# EAGLE board ATmga8_testBoard_v4 (EAGLE 6.5.0), part 1 of 3
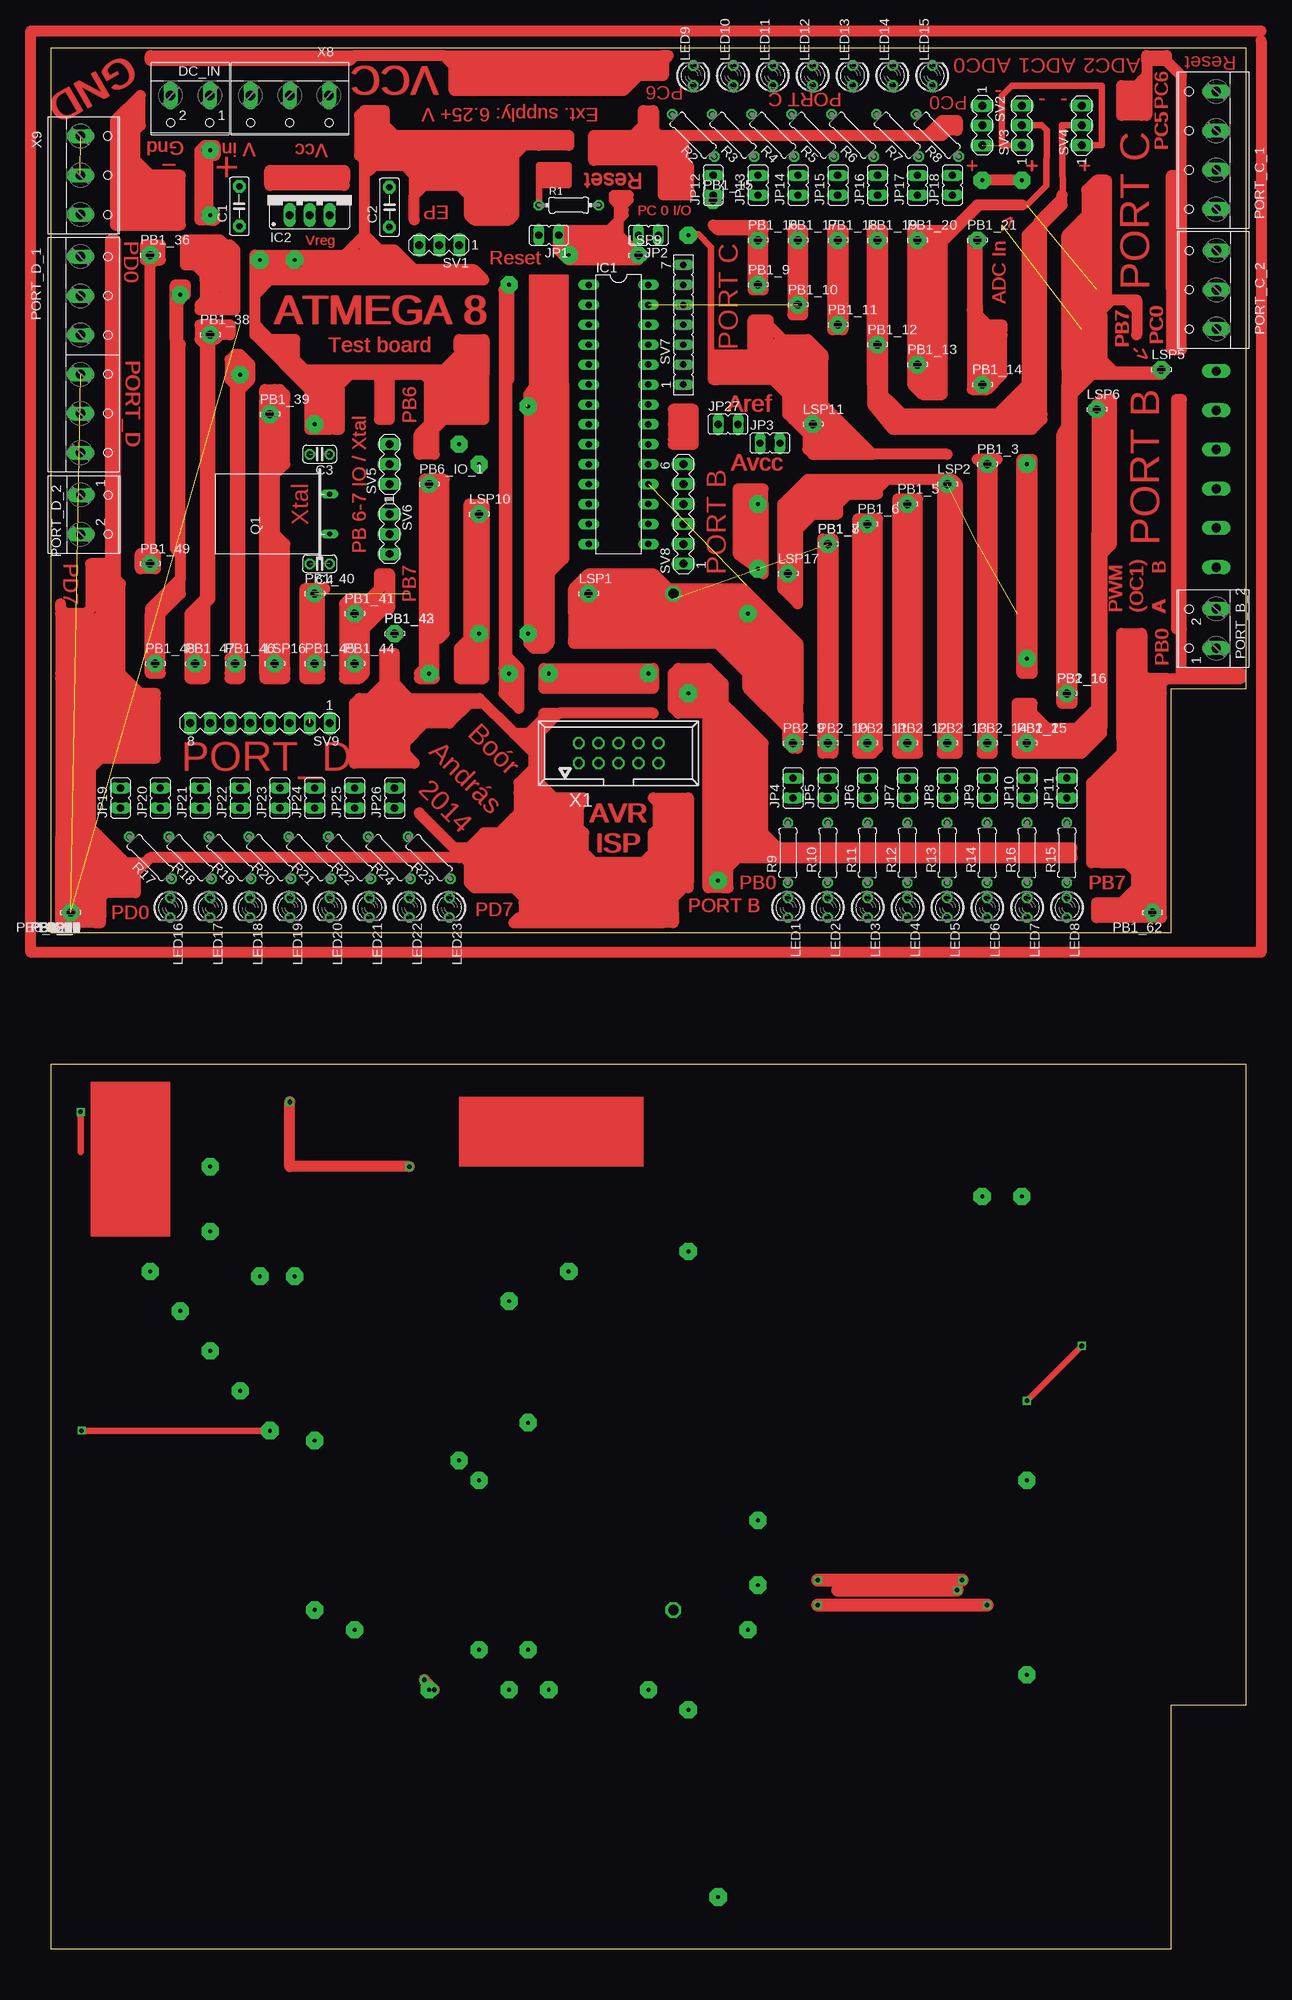
[diagram p1: board, top side]
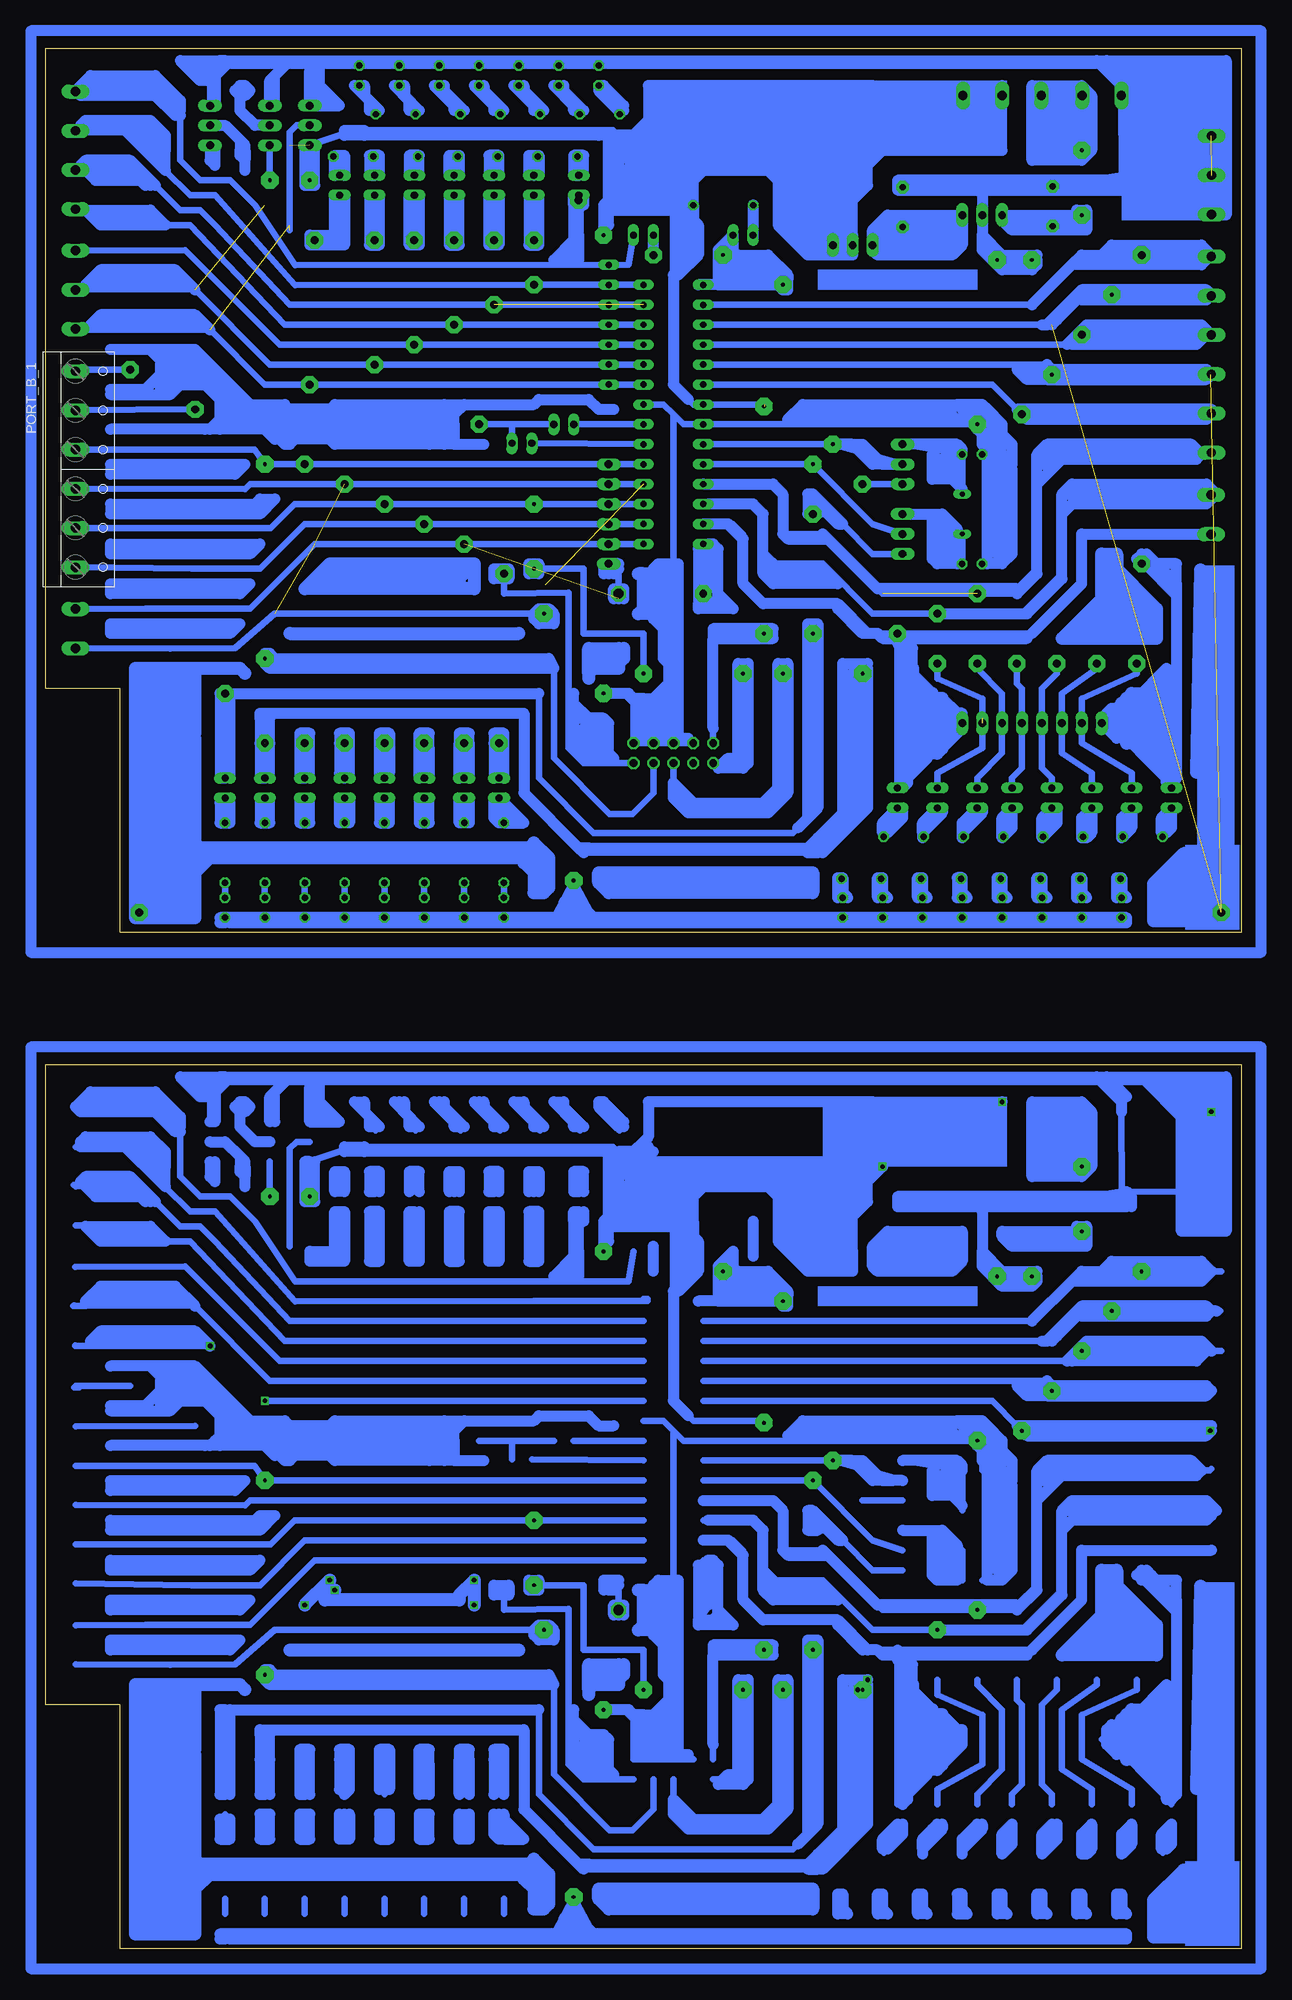
[diagram p2: board, bottom side, seen from below]

Size 152.4 x 242.24 mm. Coordinates in mm from the lower left corner, seen from the top.
Outline: 0,129.54 142.88,129.54 142.88,160.66 152.4,160.66 152.38,242.24 0,242.24 0,129.54
Outline: 0,0 142.88,0 142.88,31.11 152.4,31.11 152.38,112.7 0,112.7 0,0
Copper layers (1*16): Top 0.035mm / dielectric 1.5mm / Bottom 0.035mm
Design rules "default": minimum track width 10mil, minimum drill 24mil, track to track 8mil, track to pad 8mil, pad to pad 8mil, via to via 8mil, smd to smd 8mil, copper to edge 40mil, drill to drill 8mil, minimum pad ring 10mil, minimum via ring 8mil, stop-mask expansion 4mil, vias tented up to drill 0mil, thermal gap 10mil

## Footprints (pad centres in the part's own frame; a part is rotated, then mirrored left to right if it is on the bottom)
C5B2.5 = drill 0.813 pad 1.6 octagon: 1 -2.54,0; 2 2.54,0
C025-024X044 = drill 0.813 octagon: 1 -1.27,0; 2 1.27,0
W237-102 = drill 1.194 long: 1 -2.5,-1.27; 2 2.5,-1.27
DIL28-3 = drill 0.813 long: 1 -16.51,-3.81; 2 -13.97,-3.81; 3 -11.43,-3.81; 4 -8.89,-3.81; 5 -6.35,-3.81; 6 -3.81,-3.81; 7 -1.27,-3.81; 8 1.27,-3.81; 9 3.81,-3.81; 10 6.35,-3.81; 11 8.89,-3.81; 12 11.43,-3.81; 13 13.97,-3.81; 14 16.51,-3.81; 15 16.51,3.81; 16 13.97,3.81; 17 11.43,3.81; 18 8.89,3.81; 19 6.35,3.81; 20 3.81,3.81; 21 1.27,3.81; 22 -1.27,3.81; 23 -3.81,3.81; 24 -6.35,3.81; 25 -8.89,3.81; 26 -11.43,3.81; 27 -13.97,3.81; 28 -16.51,3.81
78XXS = drill 1.016 long: GND 0,-2.54; IN -2.54,-2.54; OUT 2.54,-2.54
JP1 = drill 0.914 long: 1 0,-1.27; 2 0,1.27
LED3MM = drill 0.813 octagon: A -1.27,0; K 1.27,0
LSP10 = drill 1.016 pad 2.159 octagon: MP 0,0
W237-6 = drill 1.194 long: 1 -12.5,-1.27; 2 -7.5,-1.27; 3 -2.5,-1.27; 4 2.5,-1.27; 5 7.5,-1.27; 6 12.5,-1.27
W237-4 = drill 1.194 long: 1 -7.5,-1.27; 2 -2.5,-1.27; 3 2.5,-1.27; 4 7.5,-1.27
W237-103 = drill 1.194 long: 1 -5,-1.29; 2 0,-1.29; 3 5,-1.29
Q = drill 0.61 long: 1 -2.54,-7.62; 2 2.54,-7.62
0204/7 = drill 0.813 octagon: 1 -3.81,0; 2 3.81,0
0207/7 = drill 0.813 octagon: 1 -3.81,0; 2 3.81,0
MA03-1 = drill 1.016 long: 1 -2.54,0; 2 0,0; 3 2.54,0
FE07 = drill 0.813 long: 1 -7.62,0; 2 -5.08,0; 3 -2.54,0; 4 0,0; 5 2.54,0; 6 5.08,0; 7 7.62,0
MA06-1 = drill 1.016 long: 1 -6.35,0; 2 -3.81,0; 3 -1.27,0; 4 1.27,0; 5 3.81,0; 6 6.35,0
MA08-1 = drill 1.016 long: 1 -8.89,0; 2 -6.35,0; 3 -3.81,0; 4 -1.27,0; 5 1.27,0; 6 3.81,0; 7 6.35,0; 8 8.89,0
057-010-1 = drill 1 octagon: 1 -5.08,-1.27; 2 -5.08,1.27; 3 -2.54,-1.27; 4 -2.54,1.27; 5 0,-1.27; 6 0,1.27; 7 2.54,-1.27; 8 2.54,1.27; 9 5.08,-1.27; 10 5.08,1.27

## Placement (x,y rotation side)
C1  0.33_uF  [C5B2.5]  24.05,222.11 90 top
C2  0.33_uF  [C5B2.5]  43.18,222 90 top
C3  [C025-024X044]  34.29,190.5 180 top
C4  [C025-024X044]  34.29,176.53 180 top
DC_IN  [W237-102]  17.78,234.95 180 top
IC1  ATmega8  [DIL28-3]  72.39,195.58 270 top
IC2  7805_CV  [78XXS]  33.02,223.52 0 top
JP1  PC0_Reset  [JP1]  63.5,218.44 90 top
JP2  PC0_IO  [JP1]  76.2,218.44 90 top
JP3  [JP1]  91.69,191.9 270 top
JP4  [JP1]  94.61,147.95 0 top
JP5  [JP1]  99.06,147.95 0 top
JP6  [JP1]  104.14,147.95 0 top
JP7  [JP1]  109.22,147.95 0 top
JP8  [JP1]  114.3,147.95 0 top
JP9  [JP1]  119.38,147.95 0 top
JP10  [JP1]  124.46,147.95 0 top
JP11  [JP1]  129.54,147.95 0 top
JP12  [JP1]  84.45,224.79 0 top
JP13  [JP1]  90.17,224.79 0 top
JP14  [JP1]  95.25,224.79 0 top
JP15  [JP1]  100.33,224.79 0 top
JP16  [JP1]  105.41,224.79 0 top
JP17  [JP1]  110.49,224.79 0 top
JP18  [JP1]  114.94,224.79 0 top
JP19  [JP1]  8.89,146.69 0 top
JP20  [JP1]  13.97,146.69 0 top
JP21  [JP1]  19.05,146.69 0 top
JP22  [JP1]  24.13,146.69 0 top
JP23  [JP1]  29.21,146.69 0 top
JP24  [JP1]  33.66,146.69 0 top
JP25  [JP1]  38.73,146.69 0 top
JP26  [JP1]  43.81,146.69 0 top
JP27  VREF_VCC  [JP1]  86.36,194.31 270 top
LED1  [LED3MM]  93.98,132.72 270 top
LED2  [LED3MM]  99.06,132.72 270 top
LED3  [LED3MM]  104.14,132.72 270 top
LED4  [LED3MM]  109.22,132.72 270 top
LED5  [LED3MM]  114.3,132.72 270 top
LED6  [LED3MM]  119.38,132.72 270 top
LED7  [LED3MM]  124.46,132.72 270 top
LED8  [LED3MM]  129.54,132.72 270 top
LED9  [LED3MM]  81.92,238.76 90 top
LED10  [LED3MM]  87,238.76 90 top
LED11  [LED3MM]  92.08,238.76 90 top
LED12  [LED3MM]  97.16,238.76 90 top
LED13  [LED3MM]  102.23,238.76 90 top
LED14  [LED3MM]  107.31,238.76 90 top
LED15  [LED3MM]  112.39,238.76 90 top
LED16  [LED3MM]  15.24,132.72 270 top
LED17  [LED3MM]  20.32,132.72 270 top
LED18  [LED3MM]  25.4,132.72 270 top
LED19  [LED3MM]  30.48,132.72 270 top
LED20  [LED3MM]  35.56,132.72 270 top
LED21  [LED3MM]  40.64,132.72 270 top
LED22  [LED3MM]  45.72,132.72 270 top
LED23  [LED3MM]  50.8,132.72 270 top
LSP1  LSP10  [LSP10]  68.58,172.72 0 top
LSP2  LSP10  [LSP10]  114.3,186.69 0 top
LSP3  LSP10  [LSP10]  2.54,132.08 180 top
LSP4  LSP10  [LSP10]  2.54,132.08 180 top
LSP5  LSP10  [LSP10]  141.6,201.29 0 top
LSP6  LSP10  [LSP10]  133.35,196.21 0 top
LSP7  LSP10  [LSP10]  2.54,132.08 180 top
LSP8  LSP10  [LSP10]  2.54,132.08 180 top
LSP9  LSP10  [LSP10]  74.93,215.9 0 top
LSP10  LSP10  [LSP10]  54.61,182.88 0 top
LSP11  LSP10  [LSP10]  97.16,194.31 0 top
LSP12  LSP10  [LSP10]  2.54,132.08 180 top
LSP13  LSP10  [LSP10]  2.54,132.08 180 top
LSP14  LSP10  [LSP10]  2.54,132.08 180 top
LSP15  LSP10  [LSP10]  2.54,132.08 180 top
LSP16  LSP10  [LSP10]  28.57,163.83 0 top
LSP17  LSP10  [LSP10]  93.98,175.26 0 top
LSP18  LSP10  [LSP10]  2.54,132.08 180 top
LSP19  LSP10  [LSP10]  2.54,132.08 180 top
PB1_1  LSP10  [LSP10]  129.54,160.02 0 top
PB1_2  LSP10  [LSP10]  124.46,153.67 0 top
PB1_3  LSP10  [LSP10]  119.38,189.23 0 top
PB1_5  LSP10  [LSP10]  109.22,184.15 0 top
PB1_6  LSP10  [LSP10]  104.14,181.61 0 top
PB1_7  LSP10  [LSP10]  99.06,179.07 0 top
PB1_8  LSP10  [LSP10]  99.06,179.07 0 top
PB1_9  LSP10  [LSP10]  90.17,212.09 0 top
PB1_10  LSP10  [LSP10]  95.25,209.55 0 top
PB1_11  LSP10  [LSP10]  100.33,207.01 0 top
PB1_12  LSP10  [LSP10]  105.41,204.47 0 top
PB1_13  LSP10  [LSP10]  110.49,201.93 0 top
PB1_14  LSP10  [LSP10]  118.75,199.39 0 top
PB1_15  LSP10  [LSP10]  84.45,222.88 0 top
PB1_16  LSP10  [LSP10]  90.17,217.81 0 top
PB1_17  LSP10  [LSP10]  95.25,217.81 0 top
PB1_18  LSP10  [LSP10]  100.33,217.81 0 top
PB1_19  LSP10  [LSP10]  105.41,217.81 0 top
PB1_20  LSP10  [LSP10]  110.49,217.81 0 top
PB1_21  LSP10  [LSP10]  118.11,217.81 0 top
PB1_22  LSP10  [LSP10]  2.54,132.08 180 top
PB1_23  LSP10  [LSP10]  2.54,132.08 180 top
PB1_24  LSP10  [LSP10]  2.54,132.08 180 top
PB1_25  LSP10  [LSP10]  2.54,132.08 180 top
PB1_26  LSP10  [LSP10]  2.54,132.08 180 top
PB1_27  LSP10  [LSP10]  2.54,132.08 180 top
PB1_28  LSP10  [LSP10]  2.54,132.08 180 top
PB1_29  LSP10  [LSP10]  2.54,132.08 180 top
PB1_30  LSP10  [LSP10]  2.54,132.08 180 top
PB1_31  LSP10  [LSP10]  2.54,132.08 180 top
PB1_32  LSP10  [LSP10]  2.54,132.08 180 top
PB1_33  LSP10  [LSP10]  2.54,132.08 180 top
PB1_34  LSP10  [LSP10]  2.54,132.08 180 top
PB1_35  LSP10  [LSP10]  2.54,132.08 180 top
PB1_36  LSP10  [LSP10]  12.7,215.9 0 top
PB1_37  LSP10  [LSP10]  2.54,132.08 180 top
PB1_38  LSP10  [LSP10]  20.32,205.74 0 top
PB1_39  LSP10  [LSP10]  27.94,195.58 0 top
PB1_40  LSP10  [LSP10]  33.66,172.72 0 top
PB1_41  LSP10  [LSP10]  38.73,170.18 0 top
PB1_42  LSP10  [LSP10]  43.81,167.64 0 top
PB1_43  LSP10  [LSP10]  43.81,167.64 0 top
PB1_44  LSP10  [LSP10]  38.73,163.83 0 top
PB1_45  LSP10  [LSP10]  33.66,163.83 0 top
PB1_46  LSP10  [LSP10]  23.5,163.83 0 top
PB1_47  LSP10  [LSP10]  18.41,163.83 0 top
PB1_48  LSP10  [LSP10]  13.34,163.83 0 top
PB1_49  LSP10  [LSP10]  12.7,176.53 0 top
PB1_50  LSP10  [LSP10]  2.54,132.08 180 top
PB1_51  LSP10  [LSP10]  2.54,132.08 180 top
PB1_52  LSP10  [LSP10]  2.54,132.08 180 top
PB1_53  LSP10  [LSP10]  2.54,132.08 180 top
PB1_54  LSP10  [LSP10]  2.54,132.08 180 top
PB1_55  LSP10  [LSP10]  2.54,132.08 180 top
PB1_56  LSP10  [LSP10]  2.54,132.08 180 top
PB1_57  LSP10  [LSP10]  2.54,132.08 180 top
PB1_58  LSP10  [LSP10]  2.54,132.08 180 top
PB1_59  LSP10  [LSP10]  2.54,132.08 180 top
PB1_60  LSP10  [LSP10]  2.54,132.08 180 top
PB1_61  LSP10  [LSP10]  2.54,132.08 180 top
PB1_62  LSP10  [LSP10]  140.46,132.08 180 top
PB2_1  LSP10  [LSP10]  2.54,132.08 180 top
PB2_2  LSP10  [LSP10]  2.54,132.08 180 top
PB2_3  LSP10  [LSP10]  2.54,132.08 180 top
PB2_4  LSP10  [LSP10]  2.54,132.08 180 top
PB2_5  LSP10  [LSP10]  2.54,132.08 180 top
PB2_6  LSP10  [LSP10]  2.54,132.08 180 top
PB2_7  LSP10  [LSP10]  2.54,132.08 180 top
PB2_8  LSP10  [LSP10]  2.54,132.08 180 top
PB2_9  LSP10  [LSP10]  94.61,153.67 0 top
PB2_10  LSP10  [LSP10]  99.06,153.67 0 top
PB2_11  LSP10  [LSP10]  104.14,153.67 0 top
PB2_12  LSP10  [LSP10]  109.22,153.67 0 top
PB2_13  LSP10  [LSP10]  114.3,153.67 0 top
PB2_14  LSP10  [LSP10]  119.38,153.67 0 top
PB2_15  LSP10  [LSP10]  124.46,153.67 0 top
PB2_16  LSP10  [LSP10]  129.54,160.02 0 top
PB2_17  LSP10  [LSP10]  2.54,132.08 180 top
PB2_18  LSP10  [LSP10]  2.54,132.08 180 top
PB2_19  LSP10  [LSP10]  2.54,132.08 180 top
PB2_20  LSP10  [LSP10]  2.54,132.08 180 top
PB2_21  LSP10  [LSP10]  2.54,132.08 180 top
PB2_22  LSP10  [LSP10]  2.54,132.08 180 top
PB2_23  LSP10  [LSP10]  2.54,132.08 180 top
PB6_IO_1  LSP10  [LSP10]  48.26,186.69 0 top
PB6_IO_2  LSP10  [LSP10]  2.54,132.08 180 top
PORT_B_1  [W237-6]  147.32,188.59 270 bottom
PORT_B_2  [W237-102]  147.32,168.27 90 top
PORT_C_1  [W237-4]  147.32,229.23 90 top
PORT_C_2  [W237-103]  147.32,211.45 90 top
PORT_D_1  PORT_D  [W237-6]  5.08,203.2 270 top
PORT_D_2  [W237-102]  5.11,182.8 270 top
Q1  [Q]  27.94,182.88 90 top
R1  10k  [0204/7]  66.04,222.25 0 top
R2  470R  [0207/7]  81.92,231.14 135 top
R3  470R  [0207/7]  87,231.14 135 top
R4  470R  [0207/7]  92.08,231.14 135 top
R5  470R  [0207/7]  97.16,231.14 135 top
R6  470R  [0207/7]  102.23,231.14 135 top
R7  470R  [0207/7]  107.95,231.14 135 top
R8  470R  [0207/7]  113.03,231.14 135 top
R9  470R  [0207/7]  93.98,139.7 90 top
R10  470R  [0207/7]  99.06,139.7 90 top
R11  470R  [0207/7]  104.14,139.7 90 top
R12  470R  [0207/7]  109.22,139.7 90 top
R13  470R  [0207/7]  114.3,139.7 90 top
R14  470R  [0207/7]  119.38,139.7 90 top
R15  470R  [0207/7]  129.54,139.7 90 top
R16  470R  [0207/7]  124.46,139.7 90 top
R17  470R  [0207/7]  12.7,139.06 135 top
R18  470R  [0207/7]  17.78,139.06 135 top
R19  470R  [0207/7]  22.86,139.06 135 top
R20  470R  [0207/7]  27.94,139.06 135 top
R21  470R  [0207/7]  33.02,139.06 135 top
R22  470R  [0207/7]  38.1,139.06 135 top
R23  470R  [0207/7]  48.26,139.06 135 top
R24  470R  [0207/7]  43.18,139.06 135 top
SV1  Power  [MA03-1]  49.53,217.17 180 top
SV2  Pot 1  [MA03-1]  118.75,232.41 270 top
SV3  Pot 2  [MA03-1]  123.83,232.41 90 top
SV4  Pot 3  [MA03-1]  131.44,232.41 90 top
SV5  Xtal/PB6  [MA03-1]  43.18,189.23 90 top
SV6  Xtal/PB7  [MA03-1]  43.18,180.34 270 top
SV7  [FE07]  80.64,207.01 90 top
SV8  [MA06-1]  80.64,182.88 90 top
SV9  [MA08-1]  26.67,156.21 180 top
X1  057-010-1  [057-010-1]  72.39,152.4 0 top
X8  VCC_out  [W237-103]  30.48,234.95 180 top
X9  GND_out  [W237-103]  5.08,226.06 270 top

## Tracks (layer width: path | path; a pad name or v marks a point on that pad's centre or on a via)
AVCC  (via drill 0.5 pad 2.18)
  Top 0.813: v124.46,164.46 v124.46,189.23
  Bottom 0.813: PORT_B_1.3 125.77,191.09 v124.46,189.23 PB1_3.MP SV8.6 IC1.19 | X1.7 74.93,147.32 77.6,144.65 80.52,144.65 87.63,151.76 87.63,163.19 | 88.27,164.46 v124.46,164.46
  Bottom 1.422: 123.83,165.1 123.19,164.46 88.27,164.46 87.63,163.19 123.83,163.19 124.46,163.83 124.46,165.1 123.83,165.1
AVCC1  (via drill 0.5 pad 2.18)
  Bottom 0.813: 148.59,61.55 125.77,61.55 v124.46,59.69 119.38,59.69 80.64,59.69 76.2,59.69 | 74.93,21.59 74.93,17.78 77.6,15.11 80.52,15.11 87.63,22.22 87.63,33.65 | 88.27,34.92 v124.46,34.92
  Bottom 1.422: 123.83,35.56 123.19,34.92 88.27,34.92 87.63,33.65 123.83,33.65 124.46,34.29 124.46,35.56 123.83,35.56
N$1
  Bottom 0.813: IC2.OUT C2.1 43.18,217.17 SV1.3
  Bottom 1.422: IC2.OUT 35.56,217.17 36.83,215.9 46.35,215.9 46.99,216.53 46.99,219.07 45.09,220.98 IC2.OUT | IC2.OUT 35.56,218.44 36.83,217.17 45.72,217.17 46.35,216.53 46.35,218.44 44.45,220.34 37.47,220.34 36.83,219.71 | 36.83,219.71 36.83,220.34 | 36.83,219.71 36.83,218.44 45.72,218.44 44.45,219.71 37.47,219.71
N$2  (via drill 0.5 pad 2.18)  (1 unrouted)
  Top 0.813: v20.32,220.98 20.32,228.6 20.32,229.23
  Top 1.422: 20.95,220.98 19.68,222.25 | 19.68,222.25 19.68,229.23 | 19.68,222.25 19.68,220.98 20.32,220.34 | 20.32,220.34 20.95,220.34 | 20.32,220.34 19.05,220.34 19.05,229.23 19.68,229.87 20.95,229.87 20.95,228.6 20.32,228.6
  Bottom 0.813: IC2.IN C1.1 v20.32,220.98 | 20.32,229.23 20.36,229.27 DC_IN.1 20.28,236.24 X8.3
  Bottom 1.422: 19.68,220.98 19.68,220.34 | 19.68,220.34 19.68,219.07 29.21,219.07 30.48,220.34 IC2.IN 20.95,220.98 | 20.95,220.98 19.68,220.98 | 19.68,220.98 20.32,220.34 | 20.32,220.34 20.95,219.71 28.57,219.71 29.21,220.34 20.32,220.34 | 20.32,220.34 v20.32,220.98 | v20.32,220.98 20.95,221.62 | 20.95,221.62 19.68,221.62 19.68,220.98 | 19.68,220.34 v20.32,220.98 | 20.95,221.62 20.95,220.98
N$3  (via drill 0.5 pad 2.18)
  Top 0.813: JP1.1 64.77,217.17 66.04,215.9 66.67,215.9 LSP9.MP | 58.42,200.02 58.42,164.46 v58.42,162.56
  Top 1.27: 72.39,220.34 70.48,218.44 | 71.75,219.71 73.03,220.98 73.03,221.62 | 73.03,222.25 73.66,222.88 73.66,223.52 71.75,223.52 71.75,222.88 73.03,221.62 | 73.03,221.62 73.03,222.25 | 73.03,222.25 72.39,222.88 72.39,218.44 72.39,217.81
  Top 1.422: 58.42,200.02 v58.42,212.09 57.78,211.45 57.78,163.19 v58.42,162.56 | JP1.1 65.41,219.07 71.75,219.07 72.39,218.44 LSP9.MP 74.93,215.26 66.04,215.26 64.77,216.53 JP1.1 | JP1.1 70.48,218.44 71.12,218.44 73.03,216.53 67.31,216.53 66.67,217.17 | 66.67,217.17 66.04,217.81 65.41,217.17 66.67,215.9 69.22,215.9 71.12,217.81 67.31,217.81 66.67,217.17 | 57.78,162.56 57.78,160.02 59.69,158.11 59.69,163.19 58.42,164.46 58.42,160.02 | 58.42,160.02 58.42,159.38 59.05,158.75 59.05,159.38 58.42,160.02
  Bottom 0.813: IC1.1 67.31,212.09 | 67.31,212.09 66.67,212.72 66.04,213.36 66.04,215.9 64.77,215.9 JP1.1 | LSP9.MP JP2.2 | X1.5 72.39,148.59 72.39,147.32 69.85,144.78 60.96,144.78 58.42,147.32 v58.42,162.56 | v58.42,212.09 66.67,212.09 67.31,212.09
  Bottom 1.422: v58.42,212.09 58.42,212.72 | 59.05,212.72 66.04,212.72 66.04,217.17 JP1.1 | JP1.1 64.77,213.36 65.41,214 65.41,213.36 66.67,212.09 | 66.67,212.09 69.22,212.09 | 66.67,212.09 59.05,212.09 58.42,211.45 57.78,211.45 57.78,212.72 | 57.78,212.72 58.42,212.72 | JP1.1 66.67,216.53 66.67,212.72 | 64.14,215.9 60.33,215.9 57.78,213.36 57.78,212.72 | 58.42,212.72 59.05,212.72 | 59.05,212.72 60.96,214.63 63.5,214.63 64.14,215.26 64.14,214 63.5,213.36 61.59,213.36 60.96,214 | LSP9.MP 74.93,219.07 | 57.78,163.83 57.78,147.32 60.33,144.78 60.96,144.78 70.48,144.78 72.39,146.69 72.39,148.59 69.85,146.05 60.96,146.05 59.05,147.95 59.05,163.83 57.78,163.83
N$4
  Top 1.422: 110.49,184.78 107.95,184.78 107.95,152.4 110.49,152.4 110.49,184.78 | 110.49,184.78 109.86,183.51 109.86,152.4 108.58,152.4 108.58,184.15
N$5  (via drill 1.3)
  Top 0.813: LSP1.MP v79.38,172.72 87.63,172.72 88.9,171.45 88.9,167 | 88.9,162.56 88.9,161.29 92.71,161.29 94.61,161.29 94.61,156.84 94.61,154.31
  Top 1.422: 94.61,156.84 93.98,156.84 90.17,160.66 92.71,160.66 92.71,160.02 95.25,157.48 | 95.25,153.03 94.61,153.03 93.98,153.67 93.98,155.57 88.9,160.66 88.9,162.56 | 88.9,162.56 88.9,167 | 88.9,167 88.9,168.91 88.27,169.54 84.45,169.54 | 81.92,169.54 69.22,169.54 67.31,171.45 67.31,172.72 67.94,173.35 | 67.94,173.35 77.47,173.35 | 78.74,173.35 88.27,173.35 95.25,166.37 95.25,158.75 | 95.25,157.48 95.25,153.67 | 95.25,157.48 95.25,158.75 | 95.25,158.75 92.71,161.29 | 89.53,164.46 84.45,169.54 | 84.45,169.54 81.92,169.54 | 81.92,169.54 80.64,170.81 67.31,170.81 66.67,170.18 | 66.67,170.18 66.67,169.54 | 66.67,169.54 66.67,167.64 66.67,167 | 66.67,167 84.45,167 | 85.72,167 88.9,167 | 88.9,167 87.63,168.27 | 87.63,168.27 87.63,168.91 87,169.54 66.67,169.54 | 66.67,169.54 67.31,168.91 67.31,167.64 67.94,168.27 87.63,168.27 | 66.67,170.18 66.67,173.35 | 66.67,173.35 67.94,173.35 | 66.67,173.35 68.58,175.26 76.83,175.26 78.74,173.35 | 78.74,173.35 77.47,173.35 | 77.47,173.35 76.2,174.62 68.58,174.62 | 88.9,162.56 85.09,166.37 | 85.09,166.37 84.45,167 | 84.45,167 85.72,167 | 85.72,167 86.36,166.37 87,166.37 89.53,163.83 | 85.09,166.37 66.67,166.37 66.67,167
  Bottom 0.813: IC1.14 LSP1.MP
  Bottom 1.422: LSP1.MP 67.94,173.35 67.94,178.44 69.22,178.44 69.22,171.45 | 69.22,171.45 67.31,171.45 66.67,172.08 66.67,172.72 | 66.67,172.72 66.67,178.44 67.31,179.07 67.94,179.07 | 66.67,172.72 64.77,170.81 69.22,170.81 69.22,171.45 | v79.38,172.72 78.74,172.72 79.38,172.08 | 79.38,172.08 80.01,172.08 80.01,173.35 78.74,173.35 78.74,172.08 79.38,172.08
N$6  (1 unrouted)
N$7
  Top 1.422: 41.91,200.02 41.91,194.94 43.18,194.94 43.18,200.02
N$8  (1 unrouted)
N$9  (1 unrouted)
N$10  (1 unrouted)
N$11  (1 unrouted)
N$12  (1 unrouted)
N$13
  Bottom 0.813: JP3.1 IC1.20
N$14  (1 unrouted)
N$15  (2 unrouted)
  Bottom 0.813: PB1_14.MP 124.46,199.39 131.44,206.38 148.61,206.38 PORT_C_2.1 | SV2.2 120.4,232.41 121.28,231.52 121.28,219.07 | IC1.23 PB1_14.MP | 121.28,199.39 PB1_14.MP
  Bottom 1.422: 131.44,206.38 133.35,208.28 145.41,208.28 146.69,207.01 133.35,207.01
N$16  (1 unrouted)
  Top 0.813: SV3.2 126.36,232.41 127,231.77 126.95,224.74 124.46,222.25 123.83,222.25 118.75,222.25 114.3,217.81 113.67,217.81 | 112.39,217.81 110.49,217.81
  Top 1.422: 111.12,198.12 109.86,199.39 109.86,219.07 111.12,219.07 | 111.12,198.12 111.12,219.07 | 111.12,219.07 114.94,219.07 | 114.94,219.07 118.11,222.25 123.83,222.25 | 114.94,219.07 114.3,218.44 | 111.12,198.12 113.67,198.12 113.67,217.81 112.39,217.81 112.39,198.75 111.76,199.39 111.76,217.17
  Bottom 0.813: 148.78,211.52 133.35,211.51 123.83,201.93 PB1_13.MP IC1.24 | 148.78,211.52 147.32,211.45 PORT_C_2.2 148.91,211.45 148.78,211.52
  Bottom 1.422: SV3.2 125.73,232.41 127.64,234.31 127.64,236.22 | 127.64,236.22 127,236.22 126.36,236.85 127,237.49 127.64,237.49 128.27,236.85 127.64,236.22
N$17
  Top 1.422: 113.67,218.44 111.76,218.44
N$18
  Bottom 0.813: 143.63,221.73 139.06,221.73 | 139.06,221.73 137.16,219.71 133.99,219.71 121.92,207.01 PB1_11.MP IC1.26 | PORT_C_1.1 143.63,221.73 | 143.63,221.73 143.5,221.73 139.06,221.73
  Bottom 1.422: 137.79,219.71 145.41,219.71 147.32,221.62 139.06,221.62 137.16,219.71 138.43,219.71 139.7,220.98 141.6,220.98 143.51,220.98 145.41,220.98
N$19  (1 unrouted)
  Bottom 0.813: 140.34,226.88 139.7,226.06 138.43,224.79 135.25,221.62 132.72,221.62 130.81,219.71 121.28,209.55 IC1.27 | 140.34,226.88 140.33,226.88 PORT_C_1.2 | 140.34,226.88 148.8,226.89
  Bottom 1.422: 139.7,225.43 139.06,225.43 | 139.06,225.43 138.43,224.79 | 139.06,225.43 141.6,227.96 147.32,227.96 147.96,227.33 146.05,225.43 139.7,225.43 | 139.7,225.43 139.06,224.79 139.7,224.79 141.6,226.69 144.78,226.69 145.41,226.06
N$20
  Bottom 0.813: PORT_C_1.3 138.43,231.77 138.43,231.73 137.25,230.46 137.25,226.72 133.99,223.52 130.81,223.52 120.65,212.09 120.57,212.06 PB1_9.MP IC1.28 | IC1.28 75.69,212.09 75.69,212.34 76.2,212.34 IC1.28
N$21
  Bottom 0.813: JP2.1 78.11,214.63 120.57,214.6 125.73,222.25 128.91,225.43 132.72,225.43 135.25,227.96 135.25,233.68 135.25,234.95 137.16,236.85 139.82,236.97 PORT_C_1.4
  Bottom 1.422: 135.25,234.31 135.25,235.58 138.43,238.76 146.69,238.76 148.59,236.85 147.96,236.22 138.43,236.22 135.89,233.68 135.25,233.68 135.25,234.31 | 135.25,234.31 139.06,238.12 145.41,238.12 146.69,236.85 139.7,236.85 139.06,237.49
N$22
  Top 0.813: R1.1 62.23,224.79 | 62.23,224.79 66.04,224.79 66.04,227.33 62.23,227.33 62.23,226.69 | 62.23,226.69 62.23,225.43 | 64.14,225.43 65.41,225.43 65.41,226.69 62.23,226.69 | 62.23,226.69 62.87,226.06 64.77,226.06 64.14,225.43 | 64.14,225.43 62.23,225.43 | 62.23,225.43 62.23,224.79
  Bottom 0.813: R1.1 JP1.2
  Bottom 1.422: R1.1 62.23,217.81
N$23  (1 unrouted)
N$24  (1 unrouted)
N$25  (via drill 0.5 pad 2.18)
  Bottom 0.813: IC1.10 v54.61,189.23 46.99,181.61 SV6.2
N$26  (via drill 0.5 pad 2.18)
  Bottom 0.813: IC1.9 v52.07,191.77 SV5.2
  Bottom 1.422: SV5.2 44.45,189.23 45.72,189.23 | 45.72,189.23 46.99,189.23 49.53,191.77 v52.07,191.77 48.26,191.77 45.72,189.23
N$27  (via drill 0.5 pad 2.18)
  Bottom 0.813: 3.81,215.9 5.28,215.9 | 5.28,215.9 PORT_D_1.1 3.81,215.9 | 5.28,215.9 PB1_36.MP 20.32,215.9 26.67,209.55 IC1.2 | 3.81,215.9 2.54,215.9
  Bottom 1.422: 3.81,215.9 5.08,214.63 21.59,214.63 | 21.59,214.63 26.67,209.55 | 21.59,214.63 20.32,215.9 17.78,215.9 16.51,217.17 5.08,217.17 3.81,215.9 | 3.81,215.9 16.51,215.9 17.14,215.26
  other vias: 12.7,215.9
N$28  (via drill 0.5 pad 2.18)  (1 unrouted)
  Bottom 0.813: 20.32,210.82 v16.51,210.82 3.81,210.82 | 3.17,210.82 2.66,210.82 PORT_D_1.2 | IC1.3 25.4,207.01
  Bottom 1.422: 3.17,210.82 3.81,210.82 | 3.81,210.82 4.45,211.45 20.32,211.45 24.13,207.64 | 24.13,207.64 23.5,207.64 | 23.5,207.64 20.32,210.82 20.32,210.19 4.45,210.19 3.81,210.82 | 23.5,207.64 24.13,207.01 24.77,207.01 | 25.4,207.01 24.77,207.01 | 24.77,207.01 24.13,207.64
N$29  (via drill 0.5 pad 2.18)
  Top 1.422: 19.68,171.45 19.68,161.92 17.78,161.92 17.78,170.18 19.68,172.08 | 19.68,171.45 20.32,172.08 PB1_38.MP 20.95,205.1 21.59,205.74 21.59,207.01 | 21.59,207.01 20.95,207.01 | 20.95,207.01 19.05,207.01 19.05,205.1 19.68,204.47 19.68,172.08 | 19.68,172.08 19.68,171.45 | 19.68,171.45 19.05,170.81 19.05,162.56 | 20.95,207.01 20.95,205.74 22.86,205.74 22.86,207.01 21.59,207.01
  Bottom 0.813: 21.59,204.47 21.27,204.79 | 21.27,204.79 PB1_38.MP | PB1_38.MP 10.2,205.74 PORT_D_1.3 | PB1_38.MP 5.08,205.74 3.81,205.74 2.54,205.74 | IC1.4 22.23,204.47 21.59,204.47 | 21.59,204.47 21.27,204.47 21.27,204.79
  Bottom 1.422: 22.23,204.47 19.68,207.01 5.08,207.01 3.81,205.74 4.45,205.74 5.71,204.47 21.59,204.47 19.68,206.38 5.71,206.38 5.08,205.74 19.68,205.74 20.32,205.1
  other vias: 20.32,205.74
N$30  (via drill 0.5 pad 2.18)  (1 unrouted)
  Top 1.422: 23.5,202.56 24.77,201.29 v24.13,200.66
  Bottom 0.813: PORT_D_1.4 3.85,200.66 v24.13,200.66 25.4,201.93 IC1.5
N$31  (via drill 0.5 pad 2.18)
  Bottom 0.813: PORT_D_1.5 3.93,195.58 PB1_39.MP 28.57,196.21 31.75,199.39 IC1.6
  Bottom 1.422: 3.81,196.21 28.57,196.21 27.3,194.94 4.45,194.94 3.81,195.58
  other vias: 27.94,195.58
N$32  (1 unrouted)
N$33
  Bottom 0.813: 38.1,182.88 Q1.1 C4.1
  Bottom 1.422: SV6.1 38.1,182.88 36.2,180.97 36.2,179.7 | 36.2,176.53 38.73,176.53 39.37,177.16 39.37,182.25 38.73,182.25 36.2,179.7 | 36.2,179.7 36.2,177.8 38.73,177.8 38.1,178.44 38.1,180.97 37.47,180.34 37.47,178.44
N$34
  Bottom 0.813: SV5.3 C3.1 35.56,186.06 Q1.2
  Bottom 1.422: 35.56,186.06 36.83,187.32 39.37,187.32 39.37,190.5 38.73,189.87 36.2,189.87 36.2,187.96 36.83,188.59 38.73,188.59 36.83,190.5 C3.1 35.56,191.13 36.2,191.77 SV5.3
N$35
  Bottom 0.813: SV6.3 46.99,177.8 50.8,181.61 52.07,182.88 53.98,182.88 LSP10.MP
  Bottom 1.422: 52.7,183.51 53.34,184.15 54.61,185.42 55.24,185.42 55.24,182.88 53.98,182.88 54.61,183.51 54.61,184.78 51.44,181.61 50.8,181.61 52.7,183.51
N$36
  Bottom 0.813: SV5.1 PB6_IO_1.MP
N$37  (via drill 0.5 pad 2.18)  (1 unrouted)
  Bottom 0.813: 52.7,179.7 45.72,172.72 PB1_40.MP 29.21,172.72 28.57,173.35 26.04,175.89 26.04,186.69 | 53.34,180.34 58.42,180.34 | 26.04,190.5 25.4,190.5 5.08,190.5 4.01,190.5 PORT_D_1.6
  Bottom 1.422: 5.71,191.13 6.35,191.77 24.77,191.77 25.4,191.13 | 25.4,190.5 25.4,191.13 | 25.4,191.13 26.04,190.5 | 26.04,186.69 26.04,175.26 28.57,172.72 | 26.04,186.69 26.04,190.5 | 26.04,190.5 25.4,189.87 25.4,189.23 24.77,189.87 22.86,189.87 | 22.86,189.87 5.71,189.87 5.08,190.5 5.71,191.13 | 5.71,191.13 24.13,191.13 22.86,189.87 | 22.86,189.87 26.04,186.69 | IC1.11 59.69,186.69 58.42,185.42 58.42,180.34 57.78,179.7 52.7,179.7 | 52.7,179.7 53.34,180.34 | 28.57,173.35 46.35,173.35 52.7,179.7
  other vias: 33.66,172.72
N$38  (via drill 0.5 pad 2.18)
  Bottom 0.813: PORT_D_2.1 22.9,185.38 22.9,175.22 27.94,170.18 38.1,170.18 PB1_41.MP 46.99,170.18 53.34,176.53 60.96,176.53 60.96,177.8 | 67.94,184.15 IC1.12
  Bottom 1.422: 51.44,173.99 59.69,173.99 60.96,175.26 60.96,177.8 | 60.96,177.8 60.96,182.88 62.23,184.15 67.94,184.15 | 60.33,175.89 59.05,175.89 | 59.05,175.89 53.98,175.89 53.34,175.26 | 52.7,174.62 53.34,175.26 | 53.34,175.26 59.69,175.26 | 60.96,177.8 59.05,175.89 | 38.1,170.18 27.3,170.18 22.86,174.62 22.86,182.88 | 22.86,182.88 22.86,185.42 | 22.86,185.42 3.81,185.42 | 3.81,184.78 4.45,184.15 21.59,184.15 22.86,182.88 | 22.86,185.42 21.59,186.69 4.45,186.69 3.17,185.42
  other vias: 38.73,170.18
N$39
  Bottom 0.813: 65.41,181.61 64.77,181.61 63.5,180.34 63.5,179.7 | 60.96,171.45 52.07,171.45 48.26,167.64 | 46.35,167.64 PB1_42.MP 26.67,167.64 | 20.32,180.34 3.85,180.34 | 3.85,180.34 PORT_D_2.2 3.81,180.34 3.85,180.34
  Bottom 1.422: 27.3,167 45.72,167 46.35,167.64 47.62,167.64 | 47.62,167.64 48.26,167.64 51.44,170.81 51.44,171.45 | 51.44,171.45 60.96,171.45 63.5,173.99 63.5,179.7 65.41,181.61 IC1.13 | 51.44,171.45 47.62,167.64 | 26.67,167.64 20.32,173.99 20.32,180.34 3.81,180.34 | 38.1,156.21 38.1,158.11 36.83,156.84 36.83,154.94 | 38.1,154.31 38.1,156.21 | 38.1,156.21 41.91,160.02 41.91,156.21 | 41.91,153.67 41.91,156.21 | 41.91,156.21 40.64,157.48 40.01,157.48 38.1,159.38 | 38.1,159.38 38.73,159.38 41.91,162.56 | 41.91,156.21 40.64,154.94 40.01,154.94 | 40.01,154.94 39.37,155.57 39.37,156.21 40.01,156.84 | 40.01,156.84 40.01,154.94 | 40.01,156.84 40.01,160.02 41.91,161.92 41.91,163.19 41.91,165.73 PB1_42.MP 43.81,166.37 42.55,165.1 42.55,151.13 | 42.55,149.22 42.55,148.59 43.18,147.95 43.18,165.1 | 40.01,152.4 40.01,151.76 42.55,149.22 | 42.55,149.22 42.55,151.13 | 42.55,151.13 41.27,152.4 | 38.1,153.03 35.56,155.57 35.56,157.48 36.2,157.48 38.1,159.38
  Bottom 1.676: 41.91,163.19 41.91,162.56 41.91,161.92 41.91,160.02 41.91,158.11 38.1,158.11 38.1,159.38 40.64,159.38 40.64,160.66 40.01,160.02 39.37,160.02 | 41.27,153.03 41.91,152.4 41.27,152.4 40.01,152.4 38.73,152.4 38.1,153.03 38.1,154.31 41.91,154.31 41.91,153.67 41.91,153.03 41.27,153.03 | 41.27,153.03 39.37,153.03
N$40  (1 unrouted)
  Bottom 0.813: PORT_B_1.4 126.96,186.06 126.36,186.69 SV8.5 IC1.18 | X1.9 83.82,151.13 85.72,153.03 85.72,172.85 93.98,172.72 LSP17.MP
N$41  (via drill 0.5 pad 2.18)
  Top 0.813: v63.5,162.56 v76.2,162.56 | v90.17,175.89 v90.17,184.15
  Bottom 0.813: PORT_B_1.5 123.7,181.09 120.65,184.15 PB1_5.MP v90.17,184.15 SV8.4 IC1.17 76.71,184.15 | X1.1 63.5,151.13 v63.5,162.56 | v76.2,162.56 76.2,167.64 83.82,167.64 83.82,175.89 89.53,175.89 v90.17,175.89
  Bottom 1.422: v90.17,175.89 89.53,175.26 90.81,175.26 90.81,176.53 89.53,176.53 89.53,175.89
N$42
  Bottom 0.813: PORT_B_1.6 133.78,175.89 125.09,175.89 119.38,181.61 PB1_6.MP SV8.3 IC1.16
N$43  (via drill 0.5 pad 2.18)  (1 unrouted)
  Bottom 0.813: 118.11,179.07 PB1_7.MP SV8.2 IC1.15 | PORT_B_2.1 136.53,165.73 128.23,165.77 123.19,170.18 90.17,170.18 v88.9,170.18
  Bottom 1.422: 90.17,170.18 89.53,170.81 88.27,170.81 87.63,170.18 87.63,168.91 89.53,168.91 90.17,169.54 90.17,170.18
N$44  (2 unrouted)
  Bottom 0.813: PB1_8.MP 118.11,179.07 126.36,170.81 139.66,170.81 PORT_B_2.2 | SV8.1 79.38,176.53 | 79.38,175.89 79.38,172.08
  Bottom 1.422: 81.28,175.89 80.64,175.89 | 80.01,175.89 79.38,175.89 79.38,176.53 81.28,176.53 81.28,175.26 80.64,175.89 | 80.64,175.89 80.01,175.89 | 80.01,175.89 80.01,175.26 80.64,175.26
N$45  (1 unrouted)
N$46
  Bottom 0.813: JP27.1 IC1.21
N$47
  Bottom 0.813: JP4.1 R9.2
  Bottom 1.422: 93.98,146.05 93.98,144.14 | 93.98,144.14 R9.2 | R9.2 94.61,143.51 95.25,144.14 95.25,146.69 JP4.1 | R9.2 91.44,143.51 93.98,146.05 | 93.98,146.69 93.98,146.05 | 93.98,144.14 93.34,144.14
N$48
  Bottom 0.813: R10.2 JP5.1
N$49
  Bottom 0.813: JP6.1 R11.2
N$50
  Bottom 0.813: R12.2 JP7.1
N$51
  Top 0.813: PB1_16.MP 90.17,212.09
  Bottom 0.813: JP13.1 PB1_16.MP
  Bottom 1.422: 89.53,217.17 89.53,223.52 JP13.1 90.81,223.52 90.81,217.17 89.53,217.17
N$52
  Bottom 0.813: JP9.1 R14.2
N$53
  Bottom 0.813: R15.2 JP11.1
N$54
  Bottom 0.813: R16.2 JP10.1
N$55
  Bottom 0.813: LED9.A R2.2
  Bottom 1.422: 78.74,234.31 78.74,234.95 81.28,237.49 LED9.A 81.92,236.85 79.38,234.31
N$56
  Top 0.813: PB1_17.MP 95.25,209.55
  Bottom 0.813: JP14.1 PB1_17.MP
  Bottom 1.422: 94.61,217.17 95.89,217.17 95.89,223.52 JP14.1 94.61,223.52 94.61,217.17
N$57
  Bottom 1.422: 111.12,223.52 111.12,217.17 109.86,217.17 109.86,223.52 111.12,223.52
N$58
  Top 0.813: PB1_18.MP 100.33,207.01
  Bottom 0.813: JP15.1 PB1_18.MP
N$59
  Bottom 0.813: R7.1 JP17.2
  Bottom 1.422: 109.86,226.06 109.86,228.6 111.12,228.6 111.12,226.06 JP17.2
N$60
  Top 0.813: PB1_20.MP 110.49,201.93
  Bottom 0.813: JP17.1 PB1_20.MP
N$61
  Top 0.813: PB1_21.MP 118.75,199.39
  Bottom 0.813: JP18.1 114.94,217.81 PB1_21.MP
N$62
  Bottom 0.813: JP12.2 R2.1
  Bottom 1.422: 83.82,226.06 83.82,228.6 85.09,228.6 85.09,226.06 JP12.2
N$63
  Bottom 1.422: 86.36,237.49 86.36,236.85 83.82,234.31 85.09,234.31 85.09,234.95 87.63,237.49 86.36,237.49
N$64
  Bottom 1.422: 92.71,237.49 91.44,237.49 91.44,236.85 88.9,234.31 90.17,234.31 90.17,234.95 92.71,237.49
N$65
  Bottom 0.813: R4.1 JP14.2
  Bottom 1.422: 94.61,226.06 94.61,228.6 95.89,228.6 95.89,226.06 JP14.2
N$66
  Bottom 0.813: R6.1 JP16.2
N$67
  Bottom 0.813: JP13.2 R3.1
  Bottom 1.422: 90.81,226.06 90.81,228.6 89.53,228.6 89.53,226.06 JP13.2
N$68
  Bottom 0.813: R8.1 JP18.2
N$69
  Bottom 0.813: R9.1 LED1.A
N$70
  Bottom 0.813: R10.1 LED2.A
N$71
  Bottom 0.813: LED3.A R11.1
N$72
  Bottom 0.813: R12.1 LED4.A
N$73
  Bottom 0.813: R13.1 LED5.A
N$74
  Bottom 0.813: R16.1 LED7.A
N$75
  Bottom 0.813: R14.1 LED6.A
N$76
  Bottom 0.813: R15.1 LED8.A
N$77
  Bottom 1.422: 113.03,237.49 111.76,237.49 111.76,236.22 109.86,234.31 111.12,234.31 111.12,235.58 113.03,237.49
N$78
  Bottom 0.813: LED10.A R3.2
N$79
  Bottom 0.813: LED11.A R4.2
N$80
  Bottom 0.813: LED12.A R5.2
  Bottom 1.422: LED12.A 96.52,237.49 96.52,236.85 93.98,234.31 95.25,234.31 95.25,234.95 97.79,237.49 LED12.A
N$81
  Bottom 0.813: LED13.A R6.2
N$82
  Bottom 0.813: LED14.A R7.2
  Bottom 1.422: LED14.A 106.68,237.49 106.68,236.22 104.78,234.31 106.05,234.31 106.05,235.58 107.95,237.49 LED14.A
N$83
  Bottom 0.813: R8.2 LED15.A
N$84
  Bottom 0.813: PB2_9.MP JP4.2
N$85
  Top 0.813: PB2_10.MP 99.06,179.07
  Bottom 0.813: JP5.2 99.06,149.86 PB2_10.MP
  Bottom 1.422: 99.69,149.22 99.69,153.03 99.69,153.67 | 99.69,153.67 98.42,153.67 | 98.42,153.67 98.42,149.22 99.06,149.86 | 98.42,153.67 98.42,154.94 99.69,154.94 99.69,153.67
N$86
  Top 1.422: 76.83,163.19 76.83,160.66 62.87,160.66 62.87,163.19 76.83,163.19 | 76.83,163.19 76.2,162.56 76.2,161.92 63.5,161.92
N$87
  Top 0.813: PB2_12.MP 109.22,184.15
  Bottom 0.813: JP7.2 109.22,149.86
  Bottom 1.422: 109.22,149.86 PB2_12.MP
N$88
  Top 0.813: PB2_13.MP 114.3,154.31 114.3,186.69 113.03,187.32 106.68,187.32 97.16,187.32 93.98,184.78 93.98,175.26
  Top 1.422: 106.68,187.32 96.52,187.32 93.98,184.78 93.34,184.15 93.34,173.35 95.25,171.45 95.25,180.97 | 106.68,187.32 114.94,187.32 115.57,186.69 115.57,156.21 | 115.57,156.21 115.57,155.57 | 115.57,155.57 114.3,154.31 114.3,185.42 114.94,186.06 113.67,186.06 | 113.03,186.69 113.67,186.06 | 113.67,186.06 113.67,152.4 115.57,152.4 115.57,155.57 | 115.57,156.21 114.94,155.57 114.94,153.03 | 95.25,180.97 95.25,184.78 94.61,184.78 94.61,172.72 | 95.25,180.97 97.16,182.88 100.33,182.88 100.33,184.15 101.6,185.42 105.41,185.42 105.41,186.06 | 106.68,187.32 105.41,186.06 | 105.41,186.06 95.89,186.06 95.89,184.78 | 95.89,184.78 95.89,182.88 97.16,184.15 | 97.16,184.15 97.79,184.78 | 97.79,184.78 100.33,184.78 99.69,184.15 97.16,184.15 | 97.16,184.15 96.52,184.78 96.52,185.42 | 98.42,185.42 97.79,184.78 | 97.79,184.78 95.89,184.78
  Bottom 1.422: JP8.2 PB2_13.MP | 113.67,153.67 114.3,153.03 JP8.2 | JP8.2 113.67,149.86 113.67,153.67 | 113.67,153.67 114.94,153.67 | 114.94,153.67 114.94,149.86 | 113.67,153.67 113.67,154.94 114.94,154.94 114.94,153.67
N$89
  Top 0.813: PB2_14.MP 119.38,189.23
  Bottom 1.422: PB2_14.MP JP9.2 120.02,149.22 120.02,154.94 118.75,154.94 118.75,149.22
N$90  (via drill 0.5 pad 2.18)
  Top 0.813: v48.26,162.56 48.26,186.69
  Bottom 0.813: PB2_15.MP 124.46,157.48 91.44,157.48 | 91.44,147.32 91.44,147.07 84.07,139.7 83.82,139.7 55.24,139.7 | 53.34,139.7 48.26,144.78 v48.26,162.56 | JP10.2 124.46,149.86
  Bottom 1.422: 47.62,163.19 47.62,145.41 53.34,139.7 53.98,139.7 | 53.98,139.7 53.98,140.97 | 53.98,140.97 53.98,141.6 | 53.98,141.6 50.8,144.78 50.8,163.83 47.62,163.83 48.9,162.56 49.53,162.56 49.53,145.41 53.34,141.6 53.34,140.97 48.9,145.41 48.9,161.92 | 53.98,140.97 54.61,140.33 | 54.61,140.33 55.24,139.7 53.98,139.7 | 124.46,149.86 PB2_15.MP | 123.83,149.22 123.83,153.67 | 123.83,153.67 125.09,153.67 | 125.09,153.67 125.09,149.22 JP10.2 | 123.83,153.67 123.83,156.84 125.09,156.84 | 125.09,156.84 125.09,153.67 | 125.09,156.84 125.09,157.48 91.44,157.48 91.44,147.32 84.45,140.33 | 84.45,140.33 83.82,139.7 83.19,140.33 | 83.19,140.33 55.24,140.33 | 54.61,140.33 55.24,140.33 | 55.24,140.33 53.98,141.6 | 83.19,140.33 84.45,140.33
N$91
  Bottom 1.422: 80.01,151.76 80.64,152.4 80.64,156.21 81.28,156.84 83.19,156.84 | 84.45,156.84 83.19,156.84 | 83.19,156.84 85.09,158.75 | 85.09,158.75 85.09,160.02 | 85.09,158.75 85.09,153.03 83.82,151.76 81.28,151.76 81.92,152.4 81.92,153.03 | 81.92,153.03 81.92,156.21 82.55,155.57 83.82,155.57 83.82,152.4 83.19,153.03 81.92,153.03 | 81.92,153.03 82.55,153.67 82.55,154.94
N$92  (1 unrouted)
N$93  (1 unrouted)
N$94  (1 unrouted)
N$95  (1 unrouted)
N$96  (1 unrouted)
N$97  (1 unrouted)
N$98  (1 unrouted)
N$99  (1 unrouted)
N$100
  Bottom 0.813: JP19.1 R17.2
  Bottom 1.422: 10.16,142.24 10.16,144.14 JP19.1 8.89,142.88 9.53,142.24
N$101
  Bottom 0.813: R18.2 JP20.1
  Bottom 1.422: JP20.1 13.97,142.88 15.24,141.6 15.24,144.14 JP20.1
N$102
  Bottom 0.813: JP21.1 R19.2
  Bottom 1.422: JP21.1 19.05,142.24 19.68,141.6 20.32,141.6 20.32,144.14 JP21.1
N$103
  Bottom 1.422: 133.35,211.45 135.89,214 145.41,214 147.32,212.09 135.25,212.09 135.25,212.72 135.89,213.36 145.41,213.36 146.05,212.72
N$104
  Bottom 0.813: JP23.1 R21.2
  Bottom 1.422: 30.48,141.6 30.48,144.14 JP23.1 29.21,142.88 30.48,141.6
N$105
  Bottom 0.813: JP24.1 R22.2
  Bottom 1.422: 35.56,141.6 35.56,142.24 | 35.56,142.24 35.56,143.51 JP24.1 33.02,145.41 33.02,144.78 35.56,142.24
N$106
  Top 1.422: 60.96,167 62.23,167 62.87,166.37 62.87,196.21 63.5,196.85 62.87,196.85 | 61.59,196.85 60.96,196.85 | 60.96,196.85 60.96,167.64 | 60.96,167.64 62.23,166.37 62.23,173.99 | 62.23,176.53 62.23,196.21 61.59,196.85 | 61.59,196.85 62.87,196.85 | 62.87,196.85 63.5,196.21 63.5,166.37 62.87,165.73 61.59,165.73 60.96,166.37 60.96,167.64 | 60.96,196.85 60.96,198.12 62.23,200.02 64.77,200.02 65.41,199.39 65.41,177.16 62.23,173.99 | 62.23,173.99 62.23,176.53 | 62.23,176.53 64.14,178.44 64.14,177.8
N$107
  Bottom 0.813: JP25.1 R24.2
  Bottom 1.422: 38.1,145.41 38.1,144.78 40.64,142.24 | 40.64,142.24 40.64,141.6 | 40.64,142.24 40.64,143.51 39.37,144.78 JP25.1
N$108
  Bottom 0.813: R17.1 LED16.A
N$109
  Bottom 0.813: R18.1 LED17.A
N$110
  Bottom 0.813: LED18.A R19.1
N$111
  Bottom 0.813: R20.1 LED19.A
N$112
  Bottom 0.813: R21.1 LED20.A
N$113
  Bottom 0.813: R24.1 LED22.A
N$114
  Bottom 0.813: R22.1 LED21.A
N$115
  Bottom 0.813: R23.1 LED23.A
N$116
  Bottom 1.422: 137.79,227.96 137.79,227.33 | 137.79,227.33 137.16,226.69 137.16,229.23 | 137.79,227.33 142.24,231.77 147.96,231.77 147.96,232.41 147.32,233.04 139.06,233.04 137.16,231.14 137.16,229.23 | 137.16,229.23 140.34,232.41 141.6,232.41 | 142.24,232.41 141.6,232.41 | 141.6,232.41 137.79,228.6
N$117
  Top 0.813: PB1_48.MP 13.34,170.81 16.51,173.99 16.51,174.62 | 16.51,176.53 16.51,204.47 16.51,210.19 16.51,210.82
  Top 1.422: 12.7,170.18 12.7,168.91 12.7,162.56 13.97,162.56 13.97,170.18 | 12.7,170.18 13.97,170.18 | 13.97,170.18 16.51,172.72 16.51,174.62 | 16.51,177.8 16.51,204.47 15.88,205.1 | 15.88,205.1 15.88,209.55 | 15.88,209.55 15.88,212.09 17.14,212.09 17.14,210.82 16.51,210.19 15.88,209.55 | 15.88,205.1 15.88,178.44 16.51,177.8 | 16.51,177.8 16.51,176.53 16.51,174.62 | 16.51,174.62 12.7,170.81 12.7,170.18
  Bottom 0.813: PB1_48.MP 13.34,162.56 20.32,159.38 SV9.7 20.32,153.67 13.97,149.86 JP20.2
N$118
  Top 0.813: PB1_47.MP 18.41,170.81 20.32,172.72 20.32,205.74
  Bottom 0.813: PB1_47.MP 18.41,163.19 22.86,160.02 SV9.6 22.86,152.4 19.05,149.86 JP21.2
N$119
  Top 0.813: PB1_46.MP 23.5,169.54 24.13,170.18 24.13,200.66
  Bottom 0.813: JP22.2 24.13,149.22 25.4,150.5 25.4,154.94 SV9.5 25.4,160.66 23.5,162.56 PB1_46.MP
N$120
  Bottom 0.813: 35.56,91.44 43.18,89.92 43.18,87.63 46.99,87.63
  Bottom 1.422: 35.56,91.44 35.56,87.63 36.83,86.36 46.35,86.36 46.99,86.99 46.99,89.53 45.09,91.44 35.56,91.44 | 35.56,91.44 35.56,88.9 36.83,87.63 45.72,87.63 46.35,86.99 46.35,88.9 44.45,90.8 37.47,90.8 36.83,90.17 | 36.83,90.17 36.83,90.8 | 36.83,90.17 36.83,88.9 45.72,88.9 44.45,90.17 37.47,90.17
N$121
  Top 0.813: PB1_45.MP 33.66,172.72
  Bottom 0.813: PB1_45.MP 33.66,163.19 30.48,160.02 SV9.3 30.48,152.4 33.66,149.22 JP24.2
N$122  (2 unrouted)
  Top 0.813: PB1_44.MP 38.73,169.54
  Bottom 0.813: PB1_44.MP 38.73,161.92 33.02,159.38 SV9.2 33.02,153.03 38.73,149.86 JP25.2
N$123
  Bottom 0.813: JP26.2 43.81,156.21 | 43.81,156.21 PB1_43.MP | SV9.1 43.81,156.21
N$124  (1 unrouted)
N$125  (1 unrouted)
N$126  (1 unrouted)
N$127  (1 unrouted)
N$128  (1 unrouted)
N$129  (1 unrouted)
N$130  (1 unrouted)
N$131
  Bottom 1.422: 93.34,174.62 95.25,174.62 95.25,175.89 93.34,175.89 93.34,174.62
N$132
  Bottom 1.676: 5.21,175.77 5.71,149.99 4.19,149.48 4.45,139.57 7.37,139.57 11.18,135.76 11.18,131.06 6.22,131.06 7.62,138.3 10.29,134.11 10.03,131.83 6.86,132.08 8.51,135.76 8.76,132.59
N$133  (via drill 0.5 pad 2.18)
  other vias: 66.04,215.9
N$134
  Bottom 1.676: 16.51,176.53 10.79,170.81 10.79,167 22.86,167 17.78,172.08 17.78,177.8 15.88,177.8 15.88,172.72 12.06,168.91 12.06,167.64 12.7,168.27 20.32,168.27 16.51,172.08 16.51,175.26 12.06,170.81 12.06,169.54 18.41,169.54 17.14,170.81 15.24,170.81
N$135  (via drill 0.5 pad 2.18)
  other vias: 20.32,229.23
N$136  (via drill 0.5 pad 2.18)
  other vias: 60.83,196.6
N$137
  Bottom 0.813: X9.1 3.79,229.89 3.81,231.14 X9.2 X9.3
N$138  (via drill 0.5 pad 2.18)
  Top 1.422: v123.83,225.43 v118.75,225.43
N$139  (via drill 0.5 pad 2.18)  (1 unrouted)
  Top 0.813: v81.28,160.02 82.55,160.02 85.09,157.48 85.09,137.16 | 85.09,136.53 v85.09,136.14 | 40.01,218.44 36.83,215.26 v31.11,215.26 v26.67,215.26 26.04,214.63 26.04,210.82 | 43.81,231.14 62.23,231.14 | 62.23,231.14 65.41,231.14 | 65.41,231.14 66.04,231.14 | 62.23,231.14 62.23,229.87 | 65.41,231.14 65.41,230.5 62.87,230.5 | 33.02,195.58 33.02,199.39 26.04,206.38 26.04,207.01 | v33.66,194.31 33.66,194.94 | 33.66,194.94 33.02,195.58 | 33.02,195.58 33.02,194.31 33.66,193.68 | 34.29,193.68 34.29,194.94 33.66,194.94
  Top 1.422: 87.63,139.06 130.18,139.06 130.18,140.33 92.71,140.33 | 85.09,135.89 83.82,135.89 | 83.82,135.89 83.82,156.84 | 83.82,156.84 84.45,157.48 80.01,157.48 79.38,158.11 79.38,162.56 80.01,163.19 83.82,163.19 85.72,161.29 85.72,158.75 | 85.72,158.75 85.72,139.06 | 85.72,139.06 85.72,137.16 | 85.72,137.16 85.72,135.25 | 85.72,135.25 83.82,135.25 83.82,135.89 | 83.82,156.84 83.82,161.92 85.09,160.66 85.09,156.84 | 85.09,136.53 85.09,137.16 | 85.09,137.16 85.09,156.84 | 85.09,156.84 83.19,158.75 80.01,158.75 80.01,161.92 82.55,161.92 83.19,162.56 83.19,160.02 80.64,160.02 80.64,161.29 81.92,161.29 82.55,160.66 | 85.09,137.16 87.63,139.7 90.81,139.7 90.81,140.33 | 90.81,140.33 90.81,153.67 87,157.48 | 85.72,158.75 87,157.48 | 87,157.48 87,155.57 | 87,155.57 87,154.31 87.63,153.67 89.53,153.67 87.63,155.57 87,155.57 | 33.02,193.68 33.66,193.68 34.29,193.68 | 34.29,193.68 34.29,199.39 | 34.29,199.39 32.38,201.29 | 32.38,201.29 31.11,202.56 | 31.11,202.56 28.57,205.1 | 28.57,205.1 27.94,205.1 27.3,205.74 | 27.3,205.74 26.04,205.74 | 26.04,205.74 33.02,198.75 33.02,193.68 | 33.02,193.68 v33.66,194.31 | 26.04,205.74 26.04,207.01 | 26.04,207.01 26.04,210.82 | 26.04,212.72 26.04,215.9 37.47,215.9 40.01,218.44 | 40.01,218.44 40.01,227.96 | 40.01,227.96 40.01,229.87 | 40.01,229.87 41.27,231.14 42.55,231.14 | 42.55,231.14 43.18,231.14 | 43.18,231.14 43.81,231.14 | 43.81,231.14 66.04,231.14 66.04,229.87 62.23,229.87 | 62.23,229.87 61.59,230.5 44.45,230.5 41.27,227.33 | 41.27,227.33 40.64,226.69 40.64,229.23 41.27,229.87 41.91,229.87 43.18,231.14 | 43.18,231.14 43.18,230.5 41.27,228.6 | 27.94,212.72 28.57,213.36 39.37,213.36 40.01,214 40.01,218.44
  Top 1.422: 27.94,212.72 26.04,210.82 | 26.04,210.82 26.04,212.72 | 26.04,212.72 27.94,214.63 38.1,214.63 38.73,214 38.73,215.26 39.37,215.9 38.1,215.9 37.47,215.26 | 27.3,205.74 26.04,207.01 | 32.38,201.29 50.16,201.29 53.34,204.47 55.24,204.47 | 55.24,204.47 55.24,201.29 | 55.24,201.29 55.24,200.66 | 55.24,200.66 53.98,200.66 | 53.98,200.66 47.62,200.66 | 47.62,200.66 38.1,200.66 | 38.1,200.66 34.92,200.66 34.29,200.02 34.29,199.39 | 27.94,212.72 55.24,212.72 53.98,214 46.35,214 43.81,216.53 40.64,216.53 40.64,214 45.09,214 | 45.72,214 45.09,214 | 45.09,214 43.18,215.9 41.91,215.9 | 41.91,215.9 41.27,215.26 43.18,215.26 43.81,214.63 | 41.91,215.9 41.91,216.53 40.01,218.44 | 41.27,227.33 45.09,227.33 46.35,226.06 | 46.35,226.06 46.99,225.43 | 46.99,225.43 51.44,225.43 | 51.44,225.43 53.34,223.52 53.34,220.98 53.98,220.34 58.42,220.34 59.05,220.98 59.05,228.6 | 59.05,228.6 59.05,229.87 47.62,229.87 | 47.62,229.87 44.45,229.87 43.18,228.6 58.42,228.6 58.42,222.25 57.78,221.62 53.98,221.62 53.98,223.52 53.34,224.15 57.15,224.15 57.15,222.25 55.24,222.25 54.61,222.88 55.24,222.88 55.88,223.52 56.52,223.52 57.78,224.79 53.34,224.79 52.7,225.43 52.07,225.43 50.16,227.33 | 50.16,227.33 46.35,227.33 | 46.35,227.33 45.72,227.96 | 46.35,227.33 47.62,226.06 48.9,226.06 | 54.61,226.06 56.52,226.06 57.15,225.43 57.15,227.96 50.8,227.96 | 50.16,227.96 50.8,227.96 | 50.8,227.96 52.07,226.69 55.88,226.69 56.52,227.33 50.16,227.33 | 50.16,227.33 47.62,229.87 | 46.35,226.06 46.35,224.79 | 46.35,224.79 46.35,223.52 | 46.35,220.34 46.35,223.52 | 46.35,223.52 48.9,226.06 | 48.9,226.06 54.61,226.06 | 54.61,226.06 53.98,225.43 53.34,225.43
  Top 1.422: 53.34,225.43 51.44,225.43 | 46.99,225.43 46.35,224.79 | 46.35,224.79 52.7,224.79 53.34,225.43 | 85.72,139.06 87,140.33 | 90.81,140.33 92.71,140.33 | 92.71,140.33 90.17,142.88 | 47.62,200.66 48.26,200.02 | 48.26,200.02 48.9,199.39 48.9,194.94 | 48.9,194.94 48.9,193.68 | 48.9,193.68 48.9,190.5 46.99,190.5 46.99,193.04 48.26,194.31 | 48.9,193.68 50.16,194.94 | 50.16,194.94 55.24,194.94 55.24,200.66 | 55.24,201.29 53.34,199.39 49.53,199.39 50.16,198.75 50.16,196.21 | 50.16,196.21 50.16,194.94 | 50.16,194.94 50.8,195.58 52.07,195.58 | 52.07,195.58 54.61,195.58 53.98,196.21 53.98,200.66 | 53.98,200.66 51.44,198.12 50.8,198.12 51.44,197.48 51.44,196.85 52.07,196.85 52.7,197.48 52.7,198.75 53.34,198.12 53.34,196.85 52.07,195.58 | 48.9,194.94 48.26,194.31 | 48.26,194.31 48.26,191.13 | 34.29,193.68 35.56,193.68 | 35.56,193.68 35.56,198.75 36.83,200.02 37.47,200.02 | 37.47,200.02 36.83,199.39 | 36.83,199.39 34.92,199.39 | 36.83,199.39 36.2,198.75 | 36.2,198.75 34.92,197.48 | 42.55,231.14 42.55,232.41 | 42.55,232.41 42.55,234.31 40.01,234.31 39.37,233.68 39.37,228.6 40.01,227.96 | 40.01,229.87 40.01,232.41 41.27,233.68 41.27,233.04 41.91,232.41 41.27,231.77 | 42.55,232.41 43.81,231.14 | 62.23,229.87 60.33,229.87 | 59.69,229.87 60.33,229.87 | 60.33,229.87 59.05,228.6 | 37.47,200.02 38.1,200.66 | 36.2,198.75 36.2,193.68 | 36.2,193.68 35.56,193.68 | 36.2,193.68 36.83,193.68 36.83,198.75 | 48.26,200.02 48.26,194.31 | 50.16,196.21 51.44,196.21 | 31.11,202.56 31.11,205.1 28.57,205.1 | 28.57,205.1 29.84,204.47 | 52.07,203.83 52.07,205.1 55.24,205.1 55.24,204.47 | 85.72,135.25 86.36,135.25 86.36,139.06 87.63,139.06 | 87.63,139.06 85.72,137.16
  Bottom 0.813: C4.2 32.38,176.53 31.75,176.53 29.21,177.8 | 29.21,188.59 29.21,189.23 31.75,190.5 C3.2 33.02,193.04 34.29,194.31 | 72.39,195.58 71.12,194.31 IC1.8 34.29,194.31 | 72.39,195.58 73.66,196.85 IC1.22 | X1.6 72.39,154.31 72.39,158.75 72.39,161.29 72.39,161.92 72.39,163.19 | 72.39,165.1 72.39,172.08 72.39,173.99 72.39,175.26 72.39,176.53 72.39,195.58 | X1.6 X1.8 X1.10 77.47,158.75 78.74,160.02 80.64,160.02 v81.28,160.02 | X1.4 X1.6 | LED8.K LED7.K LED6.K LED5.K LED4.K LED3.K LED2.K LED1.K 87.63,131.44 v85.09,136.14 82.55,131.44 LED23.K LED22.K LED21.K LED20.K LED19.K LED18.K LED17.K LED16.K | 15.24,226.06 C1.2 33.02,225.43 | 15.24,226.06 15.24,226.02 DC_IN.2 15.24,226.06 | 33.02,225.43 33.02,223.52 IC2.GND 33.02,217.17 v31.11,215.26 29.84,215.26 v26.67,215.26 | C2.2 33.02,225.43 | 3.77,225.98 5,225.98 15.24,226.06 | 3.81,231.08 3.81,236.22 7.62,240.03 12.06,240.03 LED9.K LED10.K LED11.K LED12.K LED13.K LED14.K LED15.K 117.47,240.03 118.75,240.03 | 118.75,239.39 118.75,240.03 | 123.83,238.12 122.56,240.03 | 122.56,240.03 121.92,240.03 118.75,240.03 | SV4.3 131.44,238.12 131.44,238.76 130.81,239.39 130.18,240.03 122.56,240.03 | 34.29,194.31 v33.66,194.31
  Bottom 1.422: 26.04,215.26 26.04,214.63 26.67,214 30.48,214 33.02,216.53 33.02,218.44 | 57.78,194.94 55.88,196.85 36.2,196.85 | 35.56,196.21 34.92,195.58 33.02,195.58 30.48,193.04 | 30.48,193.04 29.21,191.77 29.21,189.23 31.11,191.13 32.38,191.13 33.02,191.77 33.02,194.31 30.48,191.77 29.84,191.77 30.48,192.41 32.38,192.41 33.66,193.68 33.66,194.94 57.15,194.94 55.88,196.21 55.24,196.21 54.61,195.58 36.83,195.58 | 31.11,190.5 31.11,177.8 30.48,178.44 29.84,178.44 29.84,189.23 29.21,188.59 29.21,177.8 30.48,176.53 32.38,176.53 32.38,191.77 | 32.38,196.21 33.02,196.85 36.2,196.85 | 36.2,196.85 35.56,196.21 | 35.56,196.21 32.38,196.21 | 32.38,196.21 30.48,194.31 30.48,193.04 | 72.39,154.31 71.75,154.94 | 71.75,154.94 71.75,176.53 | 71.75,154.94 71.75,154.31 | 71.75,154.31 70.48,154.31 | 71.75,154.31 76.83,154.31 76.83,158.75 76.2,159.38 | 76.2,159.38 73.03,159.38 | 76.2,159.38 77.47,159.38 78.11,160.02 80.64,160.02 | 75.56,158.11 75.56,154.94 74.93,155.57 73.03,155.57 72.39,156.21 72.39,158.75 73.03,158.11 75.56,158.11 | 75.56,158.11 74.93,157.48 74.93,156.84 73.03,156.84 | 75.56,158.75 73.03,161.29 | 72.39,161.92 73.03,161.29 | 73.03,161.29 73.03,160.02 | 72.39,175.26 74.93,175.26 74.93,169.54 73.66,168.27 | 73.66,168.27 72.39,167 | 72.39,167 72.39,165.1 | 72.39,165.1 72.39,163.19 | 72.39,163.19 72.39,161.29 | 72.39,167 72.39,172.08 73.66,170.81 | 73.66,170.81 73.66,168.91 | 73.66,170.81 73.66,174.62 73.03,173.99 72.39,173.99 73.03,173.35 73.03,172.72 | 74.93,175.89 74.3,176.53 72.39,176.53 | 72.39,163.19 73.66,164.46 73.66,168.27 | 72.39,165.1 73.03,164.46 73.03,161.29 | LED8.K 128.91,130.81 83.82,130.81
  Bottom 1.422: 83.82,130.81 81.92,130.81 | 81.92,130.81 85.09,133.98 85.09,134.62 86.36,133.35 86.36,131.44 83.82,131.44 85.09,132.72 85.72,132.72 83.82,130.81 | 81.92,130.81 14.61,130.81 14.61,131.44 130.18,131.44 130.18,130.81 129.54,130.81 | 129.54,240.66 18.41,240.66 | 17.14,240.66 1.91,240.66 1.91,220.98 7.62,220.98 7.62,235.58 12.06,240.03 3.81,240.03 3.17,239.39 | 3.17,239.39 2.54,240.03 2.54,221.62 6.35,221.62 6.99,222.25 6.99,236.85 9.53,239.39 | 9.53,239.39 10.79,239.39 | 9.53,239.39 3.17,239.39 | 3.17,239.39 3.81,238.76 | 15.24,236.22 15.24,237.49 18.41,240.66 | 18.41,240.66 17.14,240.66 | 17.14,240.66 14.61,238.12 | 129.54,240.66 129.54,240.03 130.81,238.76 130.81,234.95 SV4.3 | 118.75,238.76 SV2.1 114.94,234.95 117.47,237.49 | 118.75,238.76 118.75,239.39 | 123.19,234.95 123.19,238.76 | 123.19,238.76 123.83,238.12 SV3.3 | 123.19,238.76 121.92,240.03 | 129.54,240.66 130.81,239.39 | 118.75,238.76 117.47,237.49 | 117.47,237.49 117.47,240.03 | 117.47,237.49 117.47,235.58 116.84,235.58 | 33.02,223.52 33.02,218.44 | 33.02,218.44 30.48,215.9 | 29.84,215.26 30.48,215.9 | 30.48,215.9 26.04,215.9 27.3,214.63 29.21,214.63 | 131.44,238.12 132.72,238.12 135.25,240.66 130.18,240.66 | 129.54,240.66 130.18,240.66 | 130.18,240.66 132.08,238.76 133.35,240.03 132.08,240.03
  Bottom 1.676: 74.93,175.26 74.93,170.18 76.83,170.18 76.2,170.81 76.2,175.26 | 76.2,175.26 76.83,175.26 | 76.2,175.26 74.93,175.26 | 74.93,175.26 75.56,174.62
N$140
  Top 1.422: 89.53,176.53 89.53,184.15 90.81,184.15 | 90.81,184.15 90.81,177.16 | 90.81,177.16 90.81,175.26 90.17,175.89 87.63,177.8 87.63,186.06 90.81,186.06 90.81,184.15 | 90.81,177.16 88.9,177.16 88.9,184.78 88.27,185.42 89.53,185.42
N$141
  Top 1.422: 118.11,199.39 118.11,207.64 | 118.11,207.64 118.11,217.17 117.47,217.81 117.47,208.91 | 117.47,208.91 117.47,198.75 119.38,198.75 | 119.38,198.75 119.38,207.01 | 118.11,207.64 118.75,207.64 119.38,207.01 | 119.38,198.75 121.28,200.66 121.28,205.74 | 121.28,205.74 121.28,206.38 | 121.28,206.38 120.02,206.38 119.38,207.01 | 119.38,207.01 121.28,207.01 121.28,206.38 | 121.28,205.74 120.02,205.74 120.02,200.66 | 119.38,207.01 117.47,208.91
N$142
  Top 1.422: 22.86,162.56 23.5,161.92 24.13,162.56 | 24.13,162.56 24.13,163.83 24.13,198.75 25.4,200.02 25.4,201.93 24.13,203.2 23.5,203.2 22.86,202.56 22.86,200.02 23.5,199.39 23.5,165.1 22.86,164.46 22.86,162.56 | 22.86,162.56 22.86,161.92 24.13,161.92 24.13,162.56
N$143
  Bottom 1.676: 54.61,135.89 54.61,134.62 80.64,134.62 81.92,135.89 81.92,137.16 54.61,137.16 54.61,135.89 | 54.61,135.89 55.24,135.25 80.01,135.25 80.64,135.89 80.01,136.53 55.24,136.53
N$144
  Bottom 1.422: 123.83,143.51 123.83,146.69 125.09,146.69 125.09,143.51 123.83,143.51
N$145
  Bottom 1.676: 78.74,165.73 78.74,164.46 79.38,163.83 79.38,163.19 82.55,163.19 83.19,162.56 | 83.19,162.56 83.19,161.92 | 83.19,162.56 83.19,165.73 79.38,165.73 80.64,164.46 81.92,164.46
N$146
  Bottom 1.676: 121.28,167.64 92.08,167.64
N$147
  Bottom 1.676: 97.79,176.53 97.79,173.35 119.38,173.35 116.2,176.53 97.79,176.53 | 97.79,176.53 99.69,174.62 99.69,173.99 116.84,173.99 115.57,175.26 100.33,175.26
N$148